# Altium schematic sheet Controlador_USB_Hub.SchDoc
size A3; SheetNumber: 2; SheetTotal: 14
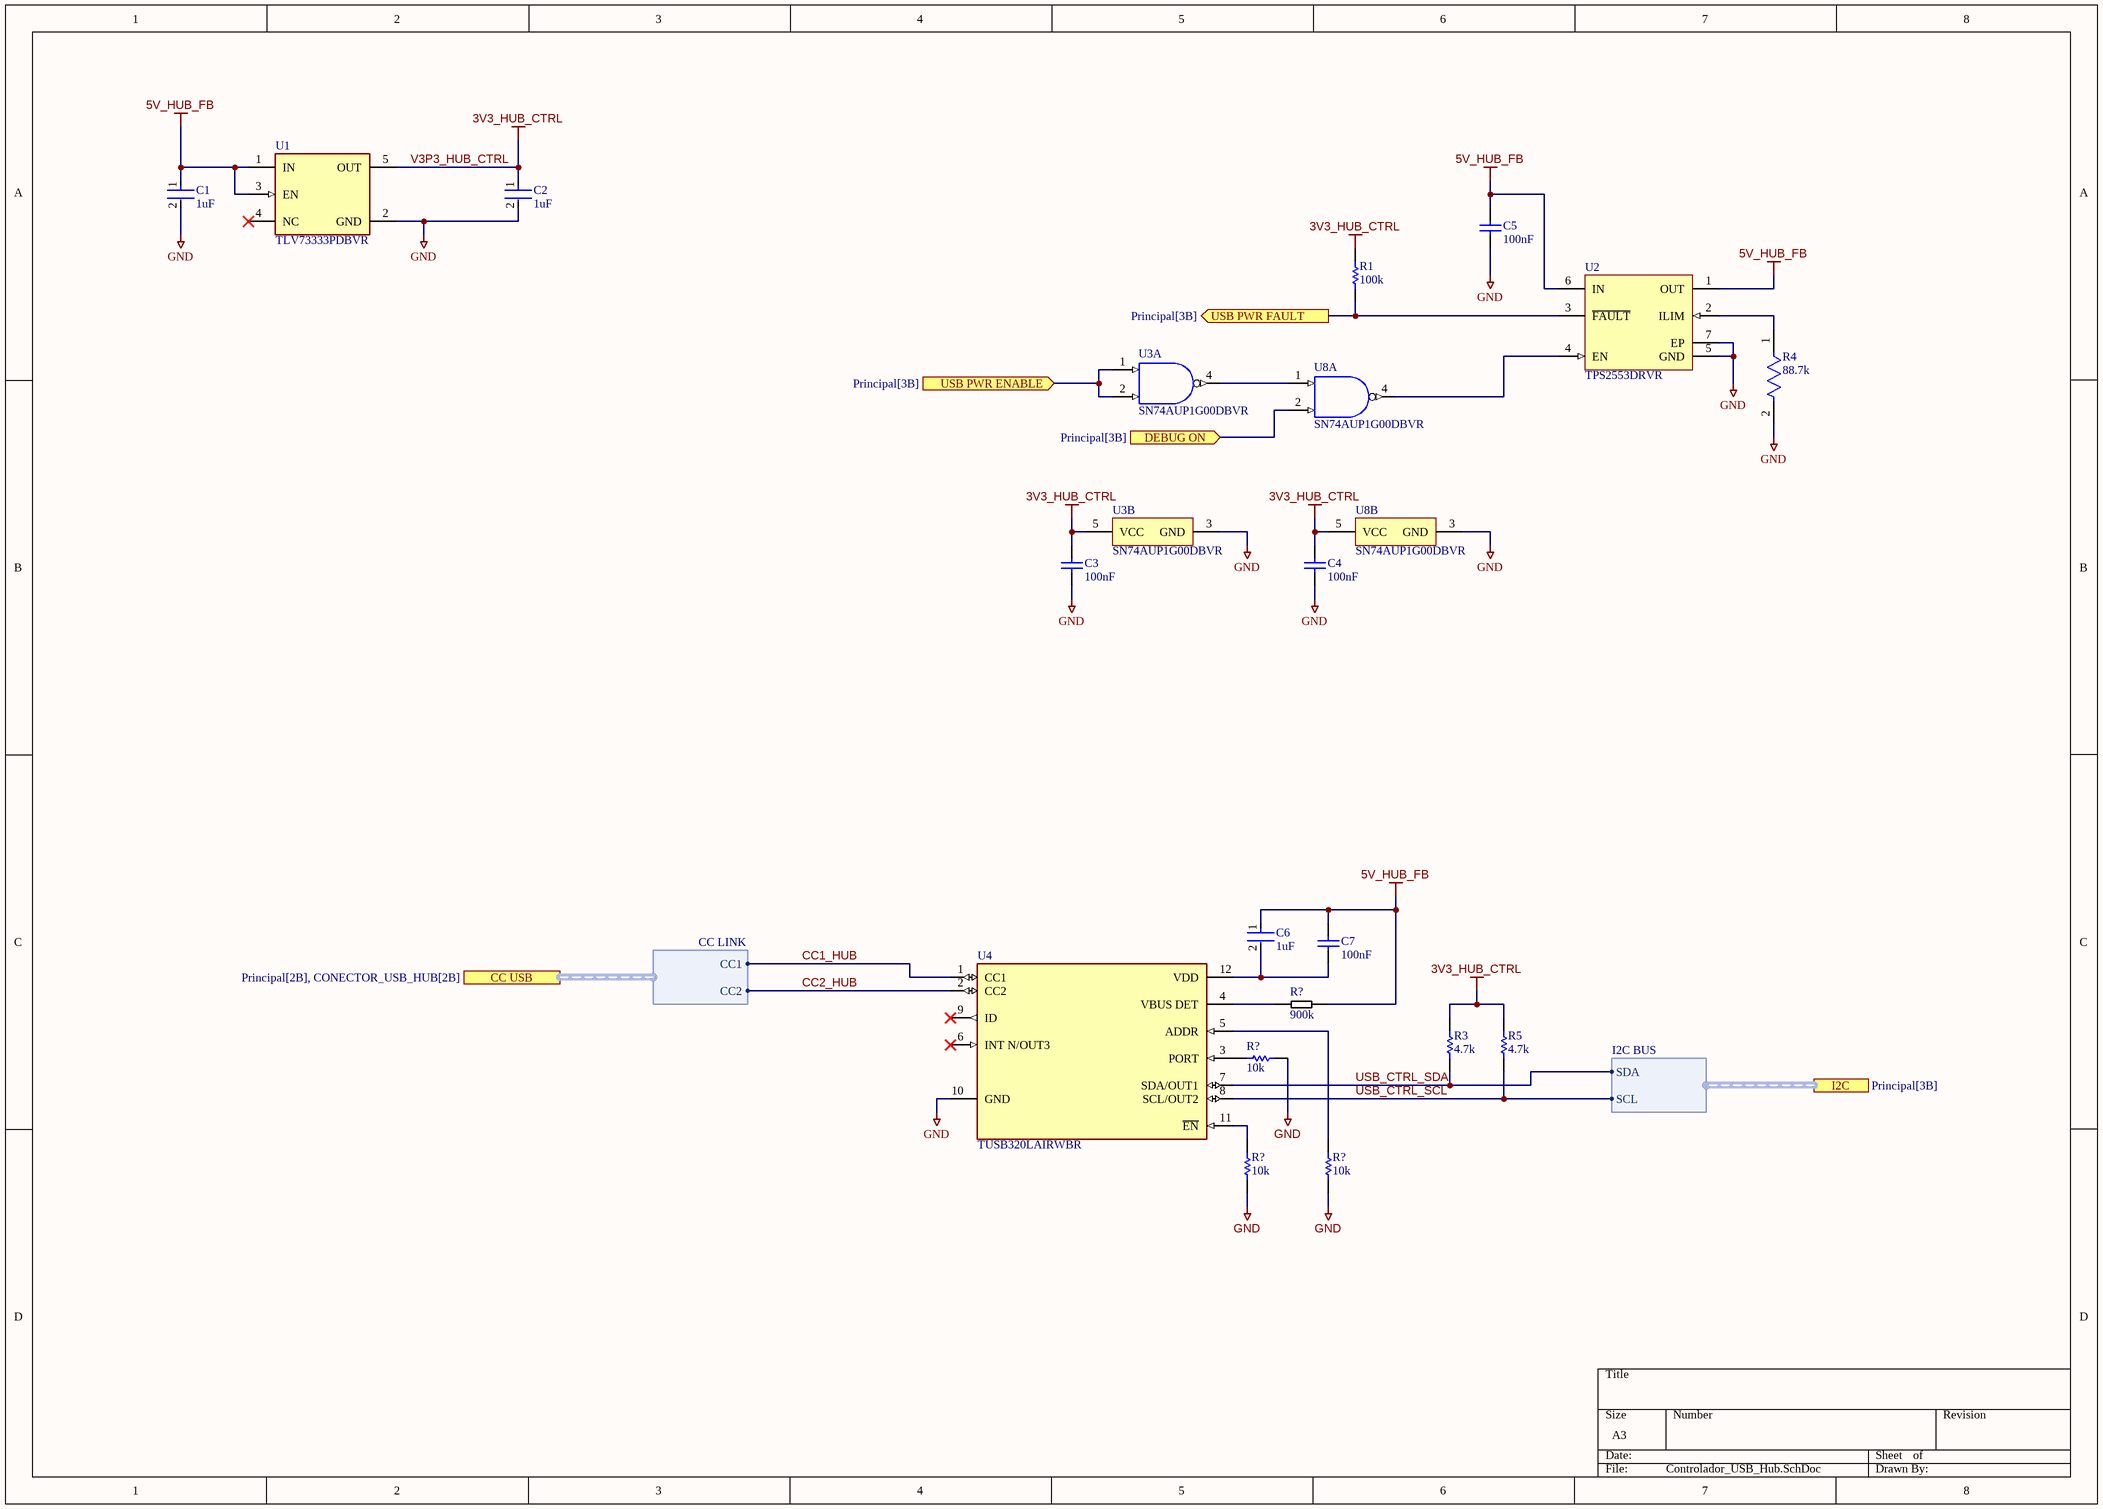
[diagram p0: Controlador_USB_Hub.SchDoc]

## Parts
(Parts that share a designator on the sheet are numbered #1, #2 ... from top to bottom, then left to right.)
C1  1uF  [FP-C0402C-BB-IPC_B]
C2  1uF  [FP-C0402C-BB-IPC_B]
C3  100nF  [CAPC1005X55X25NL05T05]
C4  100nF  [CAPC1005X55X25NL05T05]
C5  100nF  [CAPC1005X55X25NL05T05]
C6  1uF  [FP-C0402C-BB-IPC_B]
C7  100nF  [CAPC1005X55X25NL05T05]
R1  100k  [RESC1005X40X25ML05T05]
R3  4.7k  [RESC1005X40X25ML05T10]
R4  88.7k  [FP-AC0402-IPC_C]
R5  4.7k  [RESC1005X40X25ML05T10]
R?#1  900k  [RES 1206]
R?#2  10k  [RESC1005X40X25ML05T05]
R?#3  10k  [RESC1005X40X25ML05T05]
R?#4  10k  [RESC1005X40X25ML05T05]
U1  TLV73333PDBVR  [FP-DBV0005A-MFG]
U2  TPS2553DRVR  [DRV0006A_V]
U3  SN74AUP1G00DBVR  [DBV0005A_N]  (parts A,B of 2)
U4  TUSB320LAIRWBR  [FP-RWB0012A-MFG]
U8  SN74AUP1G00DBVR  [DBV0005A_N]  (parts A,B of 2)

## Ports
CC USB (harness CC LINK, see Principal[2B], CONECTOR_USB_HUB[2B]), DEBUG ON (in, see Principal[3B]), I2C (harness I2C BUS, see Principal[3B]), USB PWR ENABLE (in, see Principal[3B]), USB PWR FAULT (out, see Principal[3B])

## Harnesses
I2C BUS: SDA, SCL
CC LINK: CC1, CC2

## Nets
5V_HUB_FB: C1.1 C5.2 C6.1 C7.2 R?#1.1 U1.1(IN) U1.3(EN) U2.1(OUT) U2.6(IN)
GND: C1.2 C2.2 C3.1 C4.1 C5.1 R4.2 R?#2.1 R?#3.2 R?#4.2 U1.2(GND) U2.5(GND) U2.7(EP) U3.3(GND) U4.10(GND) U8.3(GND)
V3P3_HUB_CTRL: C2.1 C3.2 C4.2 R1.2 R3.2 R5.2 U1.5(OUT) U3.5(VCC) U8.5(VCC)  [also labelled 3V3_HUB_CTRL]
CC1_HUB: U4.1(CC1) ; port CC USB.CC1
CC2_HUB: U4.2(CC2) ; port CC USB.CC2
DEBUG ON: U8.2(B) ; port DEBUG ON
USB PWR ENABLE: U3.1(A) U3.2(B) ; port USB PWR ENABLE
USB PWR FAULT: R1.1 U2.3(~{FAULT}) ; port USB PWR FAULT
USB_CTRL_SCL: R5.1 U4.8(SCL/OUT2) ; port I2C.SCL
USB_CTRL_SDA: R3.1 U4.7(SDA/OUT1) ; port I2C.SDA
NetC6_2: C6.2 C7.1 U4.12(VDD)
NetR4_1: R4.1 U2.2(ILIM)
NetR?#1_2: R?#1.2 U4.4(VBUS_DET)
NetR?#2_2: R?#2.2 U4.3(PORT)
NetR?#3_1: R?#3.1 U4.11(~{EN})
NetR?#4_1: R?#4.1 U4.5(ADDR)
NetU2_4: U2.4(EN) U8.4(Y)
NetU3_4: U3.4(Y) U8.1(A)

Not connected (* = marked no-connect by the designer): U1 4(NC)*; U4 6(INT_N/OUT3)* 9(ID)*

## Library data of the parts
C1 C2 C6 = CMP-03020-034679-1: CAP CER 1UF 16V X5R 0402; Dielectric Material: Ceramic; Tolerance: 10%; RoHS Compliant: Yes; Voltage Rating (DC): 16V; Voltage Rating: 16V; Max Operating Temperature: 85°C; Packaging: Cut Tape; Width: 0.02inch; Dielectric: X5R; Lead Free: Lead Free; Min Operating Temperature: -55°C; Mount: Surface Mount; Case/Package: 0402; Thickness: 0.022inch; REACH SVHC: No SVHC; Length: 0.039inch; Case Code (Metric): 1005; Case Code (Imperial): 0402; Capacitance: 1uF
C3-C5 C7 = CMP-2008-02030-1: Manufacturer: Vitramon; Part Number: VJ0402Y104KXJCW1BC
R1 = CMP-2002-00602-1: Manufacturer: Panasonic; Part Number: ERJ-2RHD1003X
R3 R5 = CMP-2002-06456-1: Manufacturer: Panasonic; Part Number: ERJ-S02F4701X
R4 = CMP-03412-015208-2: RES 88.7kΩ ±1% 0.063W 0402; Resistance: 88.7kR; Max Power Dissipation: 63mW; Temperature Coefficient: 100ppm/°C; Number of Terminations: 2; Min Operating Temperature: -55°C; Features: Moisture Resistant; Width: 0.02inch; Resistor Type: Thick Film; Case/Package: 0402; Packaging: Tape and Reel; Tolerance: 1%; RoHS Compliant: Yes; Length: 0.039inch; Max Operating Temperature: 155°C; Series: AC; Height: 0.015inch
R?#1 = RT1206CRE07900KL: 900k Resistor 200V 1206 0.5%; Supplier 1: DigiKey; Supplier Part Number 1: 13-RT1206CRE07900KLCT-ND
R?#2-R?#4 = CMP-2002-00601-1: Manufacturer: Panasonic; Part Number: ERJ-2RHD1002X
U1 = CMP-04917-000053-1: IC REG LINEAR 3.3V 300MA SOT23-5; Manufacturer: Texas Instruments; Max Junction Temp: +125°C; Accuracy Percentage: 1%; Min Supply Voltage: 1.4V; Number Of Outputs: 1; Dropout Voltage: 125mV; Nominal Supply Current: 34uA; Max Supply Voltage: 5.5V; Output Type: Fixed; Standoff Height: 0mm; Digikey Description: IC REG LINEAR 3.3V 300MA SOT23-5; Manufacturer Part Number: TLV73333PDBVR; Temperature Range High: +125°C; Temperature: -40°C to +125°C; Output Current: 300mA; Mouser Description: LDO Voltage Regulators Capacitr-Free 300-mA 5-SOT-23 -40 to 125; Automotive: No; Height: 1.45mm; Device Class L3: Voltage Regulators - Linear; ComponentLink2Description: Datasheet; Device Class L1: Integrated Circuits (ICs); ComponentLink2URL: http://www.ti.com/lit/ds/symlink/tlv733p.pdf; Octopart: https://octopart.com/tlv73333pdbvr-texas+instruments-51080890; Temperature Range Low: -40°C; RoHS: TRUE; Lead Free: Yes; Output Voltage: 3.3V; Package: DBV0005A; Device Class L2: Power Management ICs; Category: IC
U2 = CMP-0337-00225-2: Adjustable, Active High, Constant-Current, Current-Limited Power-Distribution Switch, 0.075 to 1.7 A Current Limit, -40 to 85 degC, 6-pin SON (DRV), Green (RoHS & no Sb/Br); Manufacturer: Texas Instruments; Continuous Current(Max)(A): 1.5; rDS(on) per FET(Typ)(mOhms): 100/DRV, 85/DBV; Current Limit Accuracy @ 1A: +/-7.5% (925mA min / 1075mA max); Vin(Min)(V): 2.5; Vin(Max)(V): 6.5; Number of Switches: 1; Rating: Catalog; Current Limit Topology: Constant-Current; Enable: Active High; Current Limit(A): 0.075 to 1.7; PackageVersion: revE, Oct-2010; Eco-Plan: Green (RoHS & no Sb/Br); PartNumber: TPS2553DRVR; Mounting Technology: Surface Mount; ComponentLink1Description: Datasheet; PackageReference: DRV0006A; PackageDescription: 6-Pin Plastic Small Outline No-Lead, 2 x 2 x 0.8 mm Body, 0.65 mm Pitch, Exposed Pad; DatasheetVersion: SLVS841E; ComponentLink1URL: http://www.ti.com/general/docs/lit/getliterature.tsp?genericPartNumber=TPS2553&fileType=pdf
U3 U8 = CMP-0859-00110-3: Low-Power Single Two-Input Positive-NAND Gate, DBV0005A, LARGE T&R; Manufacturer: Texas Instruments; ICC @ Nom Voltage(Max)(mA): 0.0009; VCC(Max)(V): 3.6; Rating: Catalog; Schmitt Trigger: No; Voltage(Nom)(V): 0.8,1.2,1.5,1.8,2.5,3.3; Output Drive (IOL/IOH)(Max)(mA): 20/-20; Logic: True; Bits(#): 1; Technology Family: AUP; tpd @ Nom Voltage(Max)(ns): 28.4,21.9,14.7,11.5,8.1,6.5; Output Type: CMOS; Gate Type: NAND; VCC(Min)(V): 0.8; F @ Nom Voltage(Max)(Mhz): 100; PackageReference: DBV0005A; Generic Part Number: SN74AUP1G00; Sub-Family: NAND Gate; DatasheetVersion: SCES604I; 3-State Output: No; Input Type: CMOS; Operating Temperature Range(C): -40 to 85
U4 = CMP-04877-000014-1: IC USB TYPE-C LOGIC/PORT 12X2QFN; RoHS Compliant: Yes; Max Operating Temperature: 85°C; Lead Free: Lead Free; Mount: Surface Mount; Packaging: Tape and Reel; Min Operating Temperature: -40°C; Number of Pins: 12